# Altium schematic sheet Proximity-Sensor-Schematic.SchDoc
size A; SheetNumber: 2
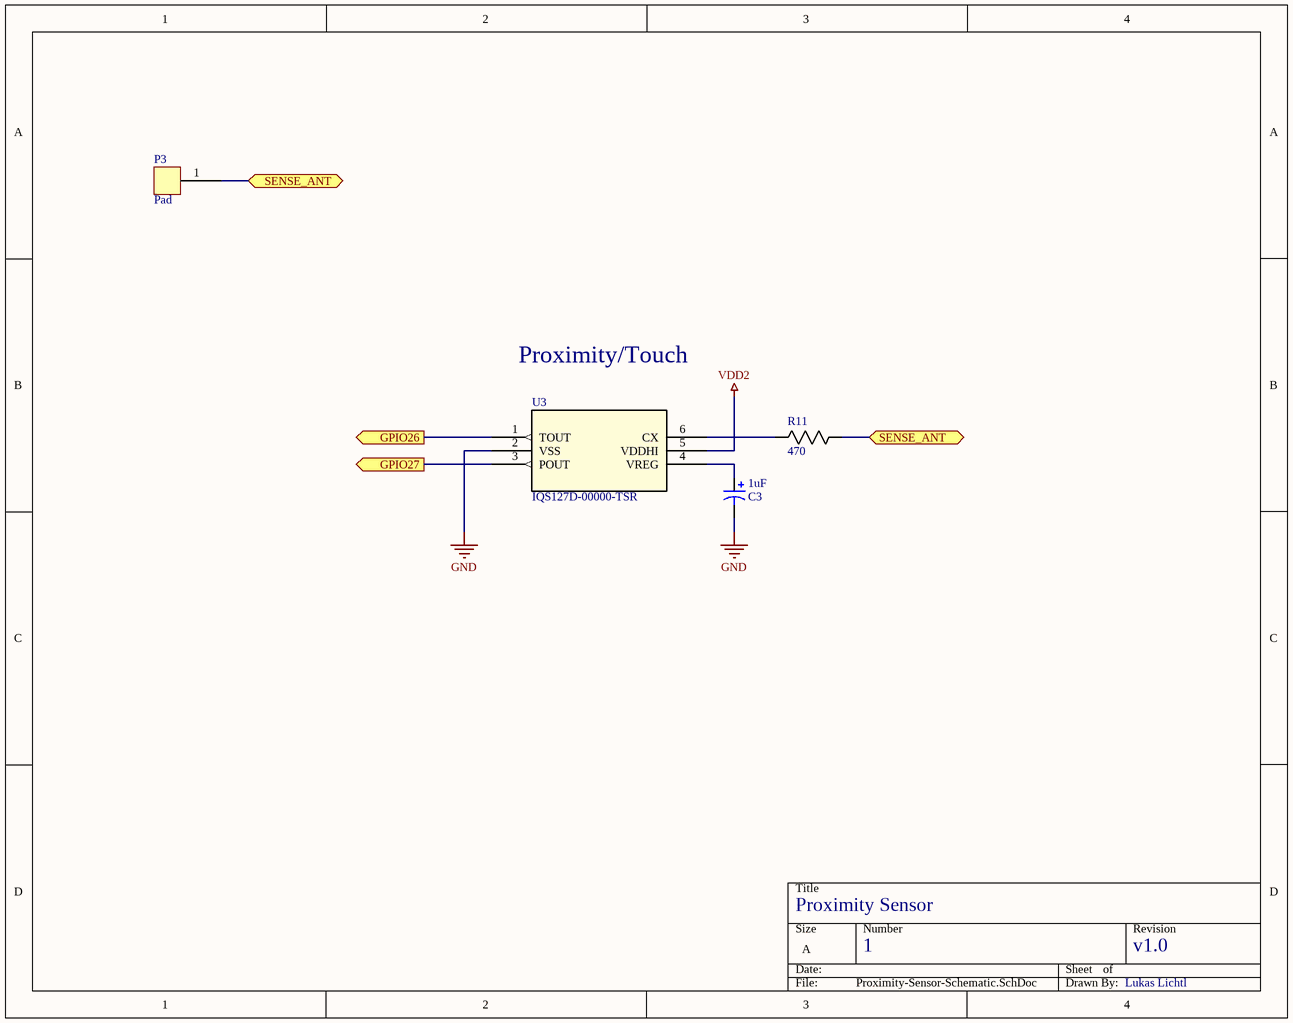
[diagram p0: Proximity-Sensor-Schematic.SchDoc]

## Parts
C3  value 1uF  [C0805]  (hidden comment: Cap Pol3)
P3  Pad  [Simple-PAD-PCB]
R11  470  [RC0603N_YAG]
U3  IQS127D-00000-TSR  [TSOT23-6_AZQ]

## Ports
GPIO26 (out), GPIO27 (out), SENSE_ANT (bidir)

## Nets
GND: C3.2 U3.2(VSS)
VDD2: U3.5(VDDHI)
GPIO26: U3.1(TOUT) ; port GPIO26
GPIO27: U3.3(POUT) ; port GPIO27
SENSE_ANT: P3.1 R11.1 ; port SENSE_ANT
NetC3_1: C3.1 U3.4(VREG)
NetR11_2: R11.2 U3.6(CX)

## Notes on the sheet
- Proximity/Touch
- Proximity Sensor
- 1
- v1.0
- Lukas Lichtl

## Library data of the parts
C3 = Cap Pol3: Polarized Capacitor (Surface Mount); Published: 8-Jun-2000; LatestRevisionDate: 29-May-2009; LatestRevisionNote: IPC-7351 Footprint Added.; PackageReference: C0805; Publisher: Altium Limited; PackageDescription: Chip Capacitor
R11 = RC0603FR-07470RL: No Description Available; Mfr_Name: Yageo
U3 = IQS127D-00000-TSR: No Description Available; Mfr_Name: Azoteq; RefDes: RefDes; Type: Type